# EAGLE design Powerboard 72V (EAGLE 5.04)
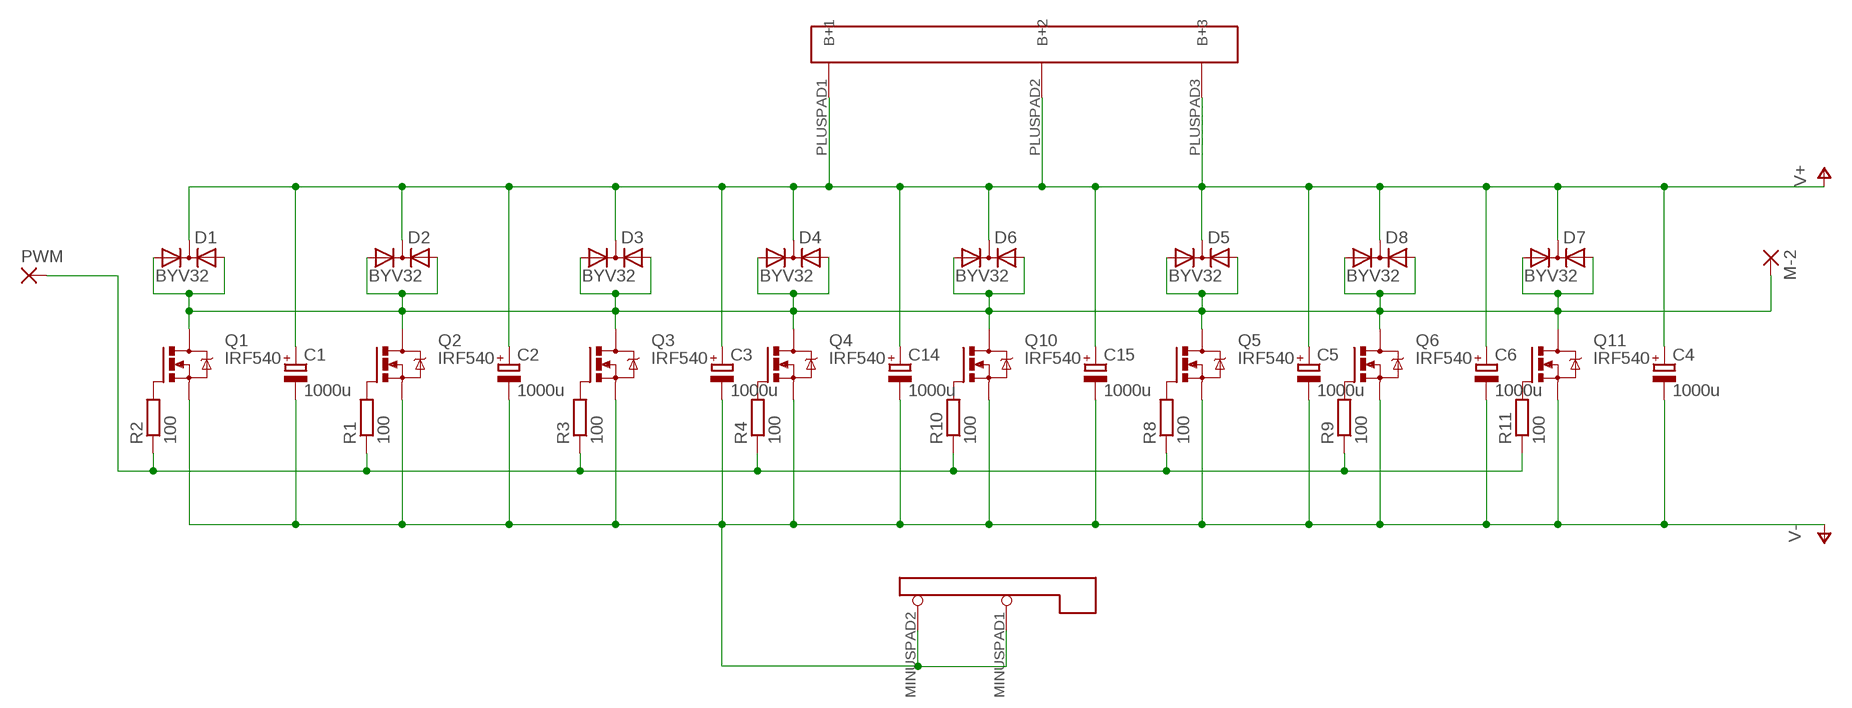
[diagram p0: schematic, sheet 1]

## Parts
C1  1000u  CPOL-EUE7.5-18  [E7,5-18]
C2  1000u  CPOL-EUE7.5-18  [E7,5-18]
C3  1000u  CPOL-EUE7.5-18  [E7,5-18]
C4  1000u  CPOL-EUE7.5-18  [E7,5-18]
C5  1000u  CPOL-EUE7.5-18  [E7,5-18]
C6  1000u  CPOL-EUE7.5-18  [E7,5-18]
C14  1000u  CPOL-EUE7.5-18  [E7,5-18]
C15  1000u  CPOL-EUE7.5-18  [E7,5-18]
D1  BYV32  [TO220ABS]
D2  BYV32  [TO220ABS]
D3  BYV32  [TO220ABS]
D4  BYV32  [TO220ABS]
D5  BYV32  [TO220ABS]
D6  BYV32  [TO220ABS]
D7  BYV32  [TO220ABS]
D8  BYV32  [TO220ABS]
M-2  3,81/1,4  [3,81/1,4]
PWM  3,81/1,4  [3,81/1,4]
Q1  IRF540  [TO220BV]
Q2  IRF540  [TO220BV]
Q3  IRF540  [TO220BV]
Q4  IRF540  [TO220BV]
Q5  IRF540  [TO220BV]
Q6  IRF540  [TO220BV]
Q10  IRF540  [TO220BV]
Q11  IRF540  [TO220BV]
R1  100  R-EU_0207/10  [0207/10]
R2  100  R-EU_0207/10  [0207/10]
R3  100  R-EU_0207/10  [0207/10]
R4  100  R-EU_0207/10  [0207/10]
R8  100  R-EU_0207/10  [0207/10]
R9  100  R-EU_0207/10  [0207/10]
R10  100  R-EU_0207/10  [0207/10]
R11  100  R-EU_0207/10  [0207/10]
U$1  B-DEV  [CURTISB-PLATESHORT]
U$2  B+DEVSHORT  [CURTIB+PLATESHORT]

## Nets
M-: D1.A1 D1.A2 D2.A1 D2.A2 D3.A1 D3.A2 D4.A1 D4.A2 D5.A1 D5.A2 D6.A1 D6.A2 D7.A1 D7.A2 D8.A1 D8.A2 M-2.1(P) Q1.D Q2.D Q3.D Q4.D Q5.D Q6.D Q10.D Q11.D
N$1: Q10.G R10.2
N$4: Q5.G R8.2
N$5: Q6.G R9.2
N$7: Q2.G R1.2
N$8: Q1.G R2.2
N$9: Q3.G R3.2
N$10: Q4.G R4.2
N$11: PWM.1(P) R1.1 R2.1 R3.1 R4.1 R8.1 R9.1 R10.1 R11.1
N$18: Q11.G R11.2
V+: C1.+ C2.+ C3.+ C4.+ C5.+ C6.+ C14.+ C15.+ D1.C D2.C D3.C D4.C D5.C D6.C D7.C D8.C U$2.PLUSPAD1(B+1) U$2.PLUSPAD2(B+2) U$2.PLUSPAD3(B+3)
V-: C1.- C2.- C3.- C4.- C5.- C6.- C14.- C15.- Q1.S Q2.S Q3.S Q4.S Q5.S Q6.S Q10.S Q11.S U$1.MINUSPAD1(BMINSUCONNECTOR2) U$1.MINUSPAD2(BMINUSCONNECTOR)

## Library data of the parts
C1-C6 C14 C15 = rcl:CPOL-EU: POLARIZED CAPACITOR, European symbol
D1-D8 = diode:BYV32: DIODE 2 x Si diode 200 V, 20 A/230 Apeak, 25 ns
M-2 PWM = wirepad:3,81/1,4: THROUGH-HOLE PAD
Q1-Q6 Q10 Q11 = transistor-power:IRF540: HEXFET Power MOSFET
R1-R4 R8-R11 = rcl:R-EU_: RESISTOR, European symbol
U$1 = CurtisParts:B-DEV
U$2 = CurtisParts:B+DEV

## Board
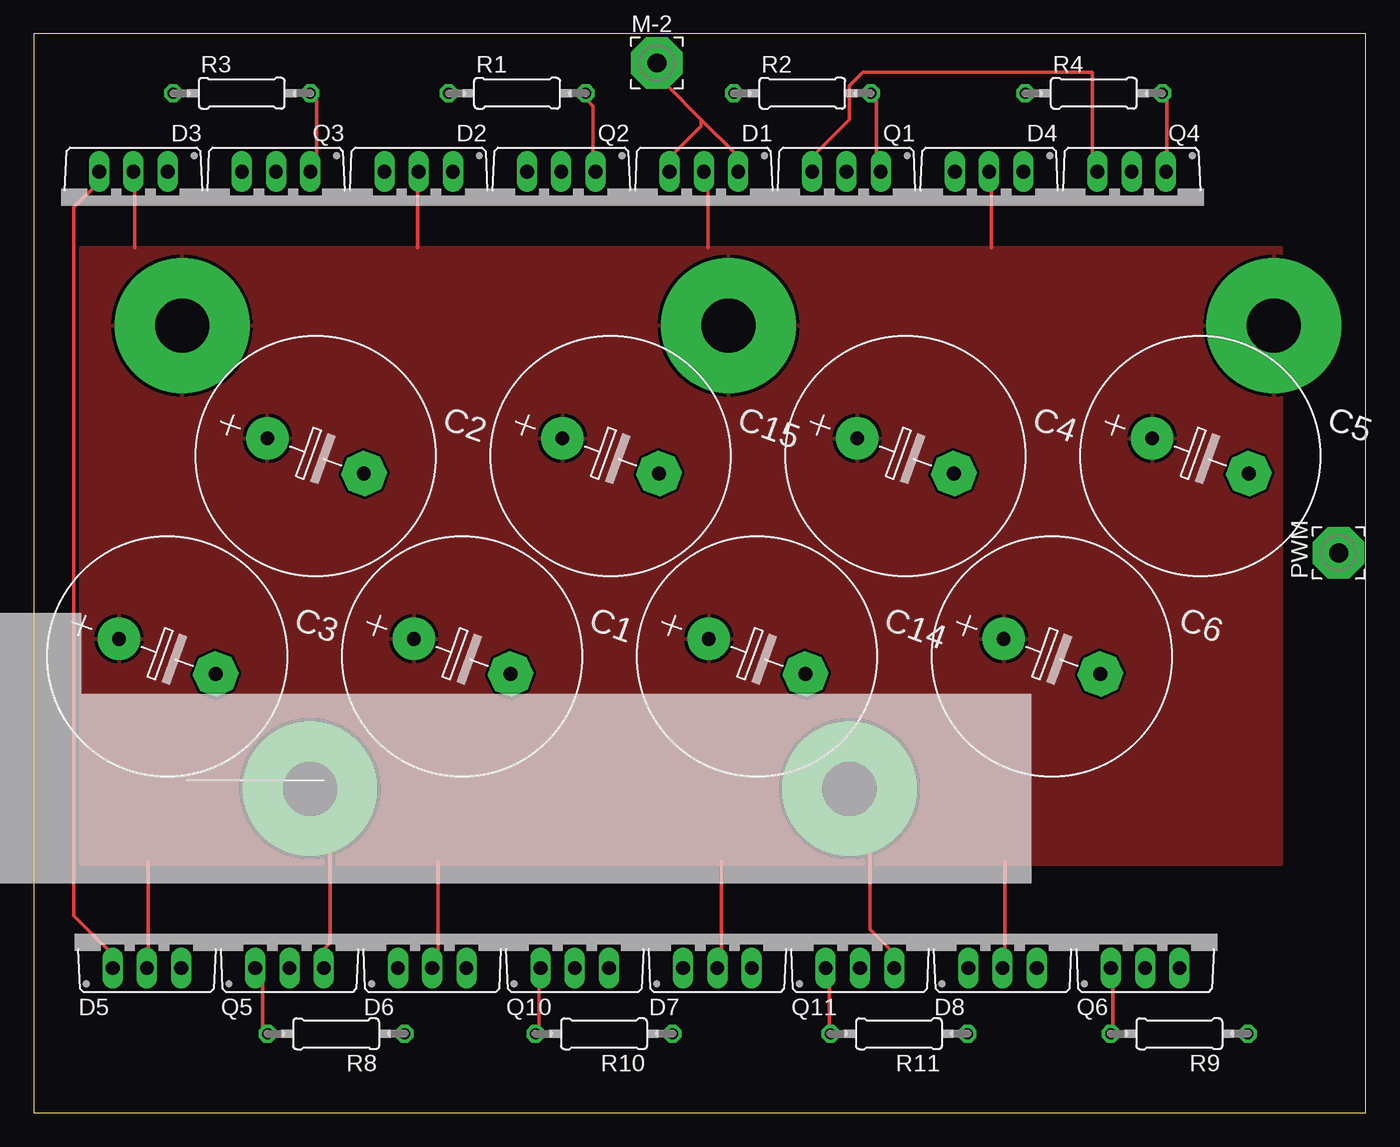
[diagram p1: board, top side]
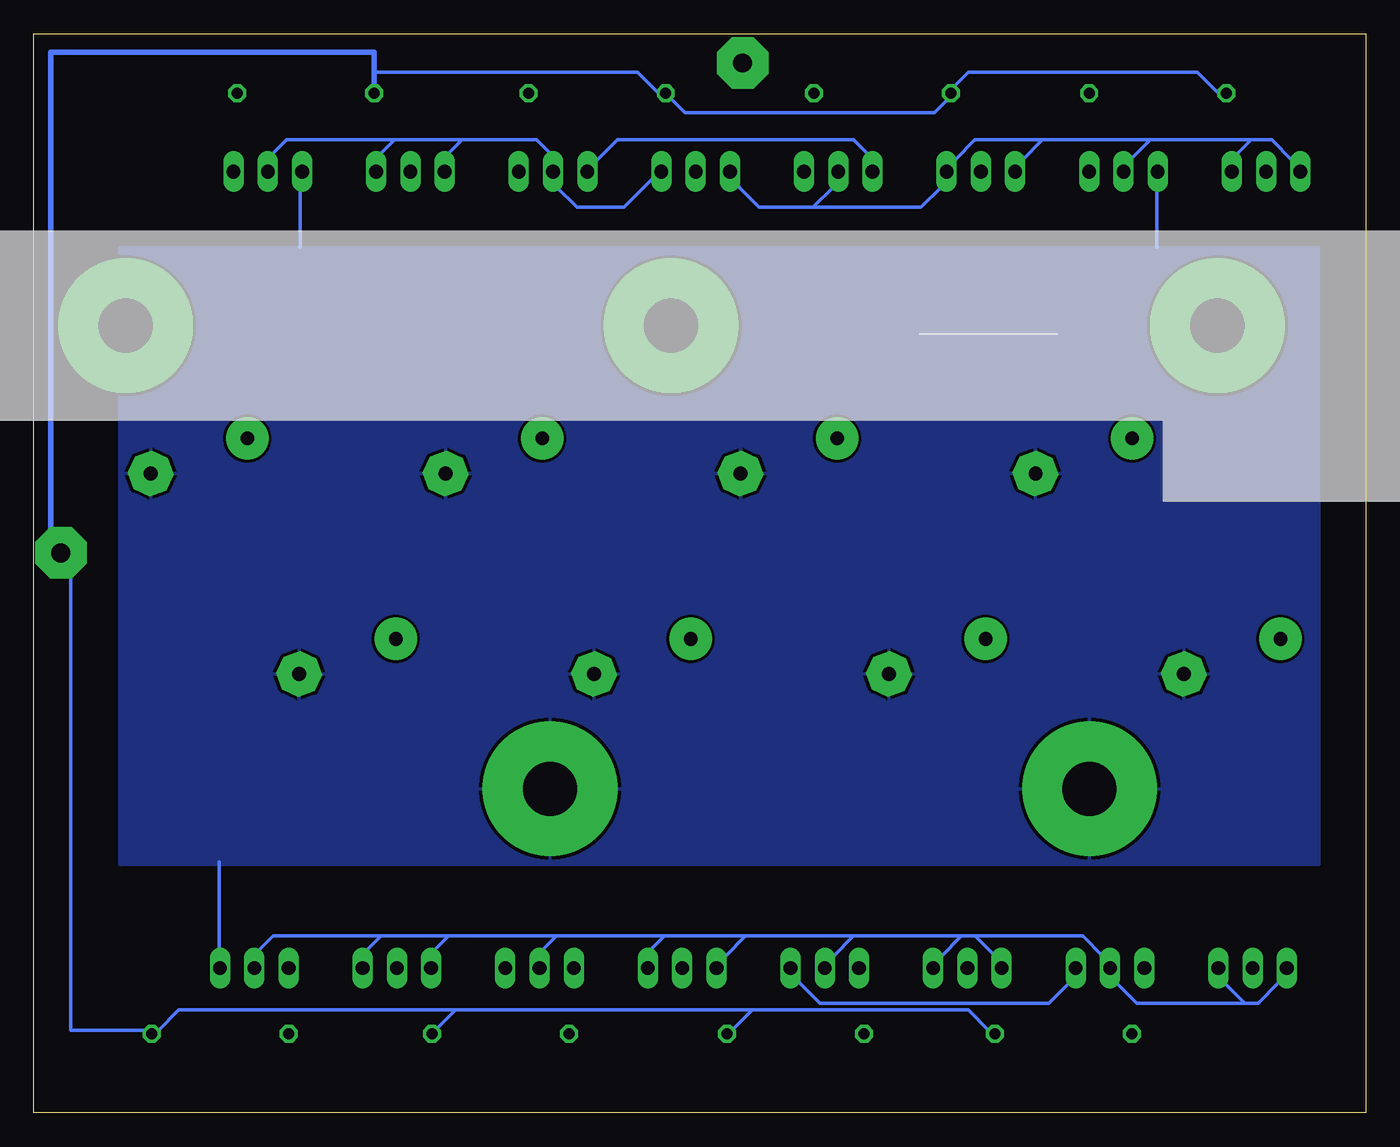
[diagram p2: board, bottom side, seen from below]

Size 98.73 x 80 mm. Coordinates in mm from the lower left corner, seen from the top.
Outline: 0,0 98.73,0 98.73,80 0,80 0,0
Copper layers (1*16): Top 0.035mm / dielectric 1.5mm / Bottom 0.035mm
Design rules "default": minimum track width 10mil, minimum drill 24mil, track to track 8mil, track to pad 0.5mm, pad to pad 1mm, via to via 1mm, smd to smd 8mil, copper to edge 40mil, drill to drill 8mil, minimum pad ring 10mil, minimum via ring 8mil, stop-mask expansion 2mm, vias tented up to drill 0mil, thermal gap 10mil

### Footprints (pad centres in the part's own frame; a part is rotated, then mirrored left to right if it is on the bottom)
E7,5-18 = drill 1.016 pad 3.15 round: + -3.81,0 | drill 1.016 pad 3.15 octagon: - 3.81,0
TO220ABS = drill 1.016 long: A1 -2.54,-2.54; A2 2.54,-2.54; C 0,-2.54
3,81/1,4 = drill 1.397 pad 3.81 octagon: 1 0,0
TO220BV = drill 1.016 long: D 0,-2.54; G -2.54,-2.54; S 2.54,-2.54
0207/10 = drill 0.813 octagon: 1 -5.08,0; 2 5.08,0
CURTISB-PLATESHORT = drill 4 pad 10 round: MINUSPAD1 51,7; MINUSPAD2 91,7
CURTIB+PLATESHORT = drill 4 pad 10 round: PLUSPAD1 41,13.32; PLUSPAD2 81.5,13.32; PLUSPAD3 121.94,13.32

### Placement (x,y rotation side)
C1  31.76,33.84 340 top
C2  20.9,48.7 340 top
C3  9.9,33.84 340 top
C4  64.62,48.7 340 top
C5  86.48,48.7 340 top
C6  75.48,33.84 340 top
C14  53.62,33.84 340 top
C15  42.76,48.7 340 top
D1  49.67,67.24 180 top
D2  28.53,67.24 180 top
D3  7.39,67.24 180 top
D4  70.81,67.24 180 top
D5  8.39,13.28 0 top
D6  29.53,13.28 0 top
D7  50.67,13.28 0 top
D8  71.81,13.28 0 top
M-2  46.19,77.83 0 top
PWM  96.72,41.52 90 top
Q1  60.24,67.24 180 top
Q2  39.1,67.24 180 top
Q3  17.96,67.24 180 top
Q4  81.38,67.24 180 top
Q5  18.96,13.28 0 top
Q6  82.38,13.28 0 top
Q10  40.1,13.28 0 top
Q11  61.24,13.28 0 top
R1  35.83,75.59 0 top
R2  56.97,75.59 0 top
R3  15.42,75.59 0 top
R4  78.57,75.59 0 top
R8  22.41,5.87 180 top
R9  84.91,5.87 180 top
R10  42.27,5.87 180 top
R11  64.13,5.87 180 top
U$1  -30.53,17.04 0 top
U$2  -30.01,45.04 0 top

### Tracks (layer width: path | path; a pad name or v marks a point on that pad's centre or on a via)
M-
  Top 0.254: 49.47,73.63 46.97,76.13 M-2.1 | 49.47,73.63 51.97,71.13 D1.A1 | 49.47,73.63 49.47,73.13 47.47,71.13 D1.A2 | D5.A1 5.47,12.13 2.97,14.63 2.97,67.13 4.47,68.63 D3.A2
  Bottom 0.254: 8.97,8.13 7.97,8.13 6.47,9.63 D5.A1 | 8.97,8.13 10.47,9.63 D5.A2 | 8.97,8.13 16.97,8.13 18.47,9.63 Q5.D 19.47,11.63 20.97,13.13 28.97,13.13 | 28.97,13.13 27.47,11.63 D6.A1 | 28.97,13.13 29.97,13.13 | 29.97,13.13 31.47,11.63 D6.A2 | 37.97,13.13 39.47,11.63 Q10.D | 29.97,13.13 37.97,13.13 | 45.97,13.13 47.47,11.63 D7.A1 | 37.97,13.13 45.97,13.13 | 51.97,13.13 52.97,12.13 D7.A2 | 45.97,13.13 51.97,13.13 | 59.97,13.13 60.97,12.13 Q11.D | 51.97,13.13 59.97,13.13 | 67.97,13.13 68.97,12.13 D8.A1 | 59.97,13.13 67.97,13.13 | 72.97,13.13 73.97,12.13 D8.A2 | 67.97,13.13 72.97,13.13 | 72.97,13.13 80.97,13.13 81.97,12.13 Q6.D | 8.47,72.13 6.97,72.13 5.47,70.63 D3.A2 | 8.47,72.13 9.47,71.13 D3.A1 | 15.97,72.13 17.47,70.63 Q3.D | 8.47,72.13 15.97,72.13 | 23.97,72.13 25.47,70.63 D2.A2 | 15.97,72.13 23.97,72.13 | 23.97,72.13 28.97,72.13 30.47,70.63 D2.A1 31.47,68.63 32.97,67.13 40.97,67.13 | 66.97,72.13 61.47,72.13 60.47,71.13 Q1.D 59.97,68.63 58.47,67.13 54.97,67.13 52.97,69.13 D1.A1 | 66.97,72.13 67.97,71.13 D4.A2 | 71.97,72.13 72.97,71.13 D4.A1 | 66.97,72.13 71.97,72.13 | 71.97,72.13 79.97,72.13 80.97,71.13 Q4.D | 40.97,67.13 39.47,68.63 Q2.D | 40.97,67.13 44.97,67.13 46.47,68.63 D1.A2
N$1
  Top 0.254: R10.2 37.47,6.13 37.47,9.63 Q10.G
N$4
  Top 0.254: R8.2 16.97,6.13 16.97,9.63 Q5.G
N$5
  Top 0.254: R9.2 79.97,6.13 79.97,9.63 Q6.G
N$7
  Top 0.254: R1.2 40.97,75.13 41.47,74.63 41.47,71.13 Q2.G
N$8
  Top 0.254: R2.2 62.47,75.13 62.47,71.13 Q1.G
N$9
  Top 0.254: R3.2 20.97,75.13 20.97,71.13 Q3.G
N$10
  Top 0.254: R4.2 83.97,75.13 83.97,71.13 Q4.G
N$11
  Bottom 0.254: 73.49,77.13 53.97,77.13 52.47,75.63 R2.1 51.47,75.13 50.47,74.13 31.97,74.13 30.97,75.13 R1.1 30.47,76.13 29.47,77.13 12.47,77.13 10.97,75.63 R3.1 | 45.47,7.63 29.47,7.63 27.97,6.13 R8.1 | 45.47,7.63 46.97,6.13 R10.1 | 67.47,7.63 68.97,6.13 R11.1 | 45.47,7.63 67.47,7.63 | 67.47,7.63 87.97,7.63 89.47,6.13 R9.1 90.47,6.13 95.97,6.13 95.97,39.63 PWM.1
  Bottom 0.406: PWM.1 97.47,41.52 97.47,78.63 73.49,78.63 73.49,77.13 R4.1
N$18
  Top 0.254: R11.2 58.97,6.13 58.97,9.63 Q11.G
V+
  Top 0.254: 8.47,18.63 8.47,12.13 D5.C | 29.97,18.63 29.97,12.13 D6.C | 50.97,18.63 50.97,12.13 D7.C | 71.97,18.63 71.97,12.13 D8.C | 7.47,64.13 7.47,68.63 D3.C | 28.47,64.13 28.47,68.63 D2.C | 49.97,64.13 49.97,68.63 D1.C | 70.97,64.13 70.97,68.63 D4.C
  pour Top: 3.47,64.13 3.47,18.41 92.48,18.41 92.48,64.13
V-
  Top 0.254: Q5.S 21.47,12.13 21.97,12.63 21.97,19.13 U$1.MINUSPAD1 | Q11.S 63.47,12.13 61.97,13.63 61.97,19.13 U$1.MINUSPAD2 | Q1.S 57.97,71.13 60.47,73.63 60.47,76.13 61.47,77.13 78.47,77.13 78.47,71.13 Q4.S
  Bottom 0.254: Q2.S 36.97,71.13 37.97,72.13 55.47,72.13 56.97,70.63 Q1.S | Q10.S 41.97,9.63 40.47,8.13 23.47,8.13 21.97,9.63 Q5.S | 15.47,64.13 15.47,68.63 Q3.S | 84.97,18.63 84.97,12.13 Q6.S | 78.97,64.13 78.97,68.63 Q4.S
  pour Bottom: 3.47,64.13 3.47,18.41 92.37,18.41 92.37,64.13